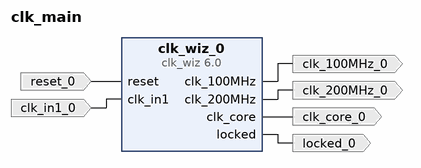
[diagram p0: block diagram of the top level]
# Vivado block design clk_main, xc7s50csga324-2, Vivado 2018.1
create_bd_design clk_main

create_bd_port -dir I -type rst reset_0
set_property -dict {CONFIG.POLARITY ACTIVE_HIGH} [get_bd_ports reset_0]
create_bd_port -dir I -type clk clk_in1_0
create_bd_port -dir O locked_0
create_bd_port -dir O -type clk clk_100MHz_0
create_bd_port -dir O -type clk clk_200MHz_0
set_property -dict {CONFIG.FREQ_HZ 200000000} [get_bd_ports clk_200MHz_0]
create_bd_port -dir O -type clk clk_core_0

create_bd_cell -type ip -vlnv xilinx.com:ip:clk_wiz:6.0 clk_wiz_0
set_property -dict [list \
  CONFIG.CLKOUT2_USED true \
  CONFIG.CLKOUT3_USED true \
  CONFIG.CLKOUT4_USED false \
  CONFIG.CLKOUT5_USED false \
  CONFIG.NUM_OUT_CLKS 3 \
  CONFIG.CLK_OUT1_PORT clk_100MHz \
  CONFIG.CLK_OUT2_PORT clk_200MHz \
  CONFIG.CLK_OUT3_PORT clk_core \
  CONFIG.CLK_OUT4_PORT clk_pixel \
  CONFIG.CLK_OUT5_PORT clk_out5 \
  CONFIG.CLKOUT2_REQUESTED_OUT_FREQ 200.000 \
  CONFIG.CLKOUT3_REQUESTED_OUT_FREQ 100 \
  CONFIG.CLKOUT4_REQUESTED_OUT_FREQ 74.25 \
  CONFIG.CLKOUT5_REQUESTED_OUT_FREQ 100.000 \
  CONFIG.MMCM_DIVCLK_DIVIDE 1 \
  CONFIG.MMCM_CLKFBOUT_MULT_F 10.000 \
  CONFIG.MMCM_CLKOUT0_DIVIDE_F 10.000 \
  CONFIG.MMCM_CLKOUT1_DIVIDE 5 \
  CONFIG.MMCM_CLKOUT2_DIVIDE 10 \
  CONFIG.MMCM_CLKOUT3_DIVIDE 1 \
  CONFIG.MMCM_CLKOUT4_DIVIDE 1 \
  CONFIG.CLKOUT1_JITTER 130.958 \
  CONFIG.CLKOUT1_PHASE_ERROR 98.575 \
  CONFIG.CLKOUT2_JITTER 114.829 \
  CONFIG.CLKOUT2_PHASE_ERROR 98.575 \
  CONFIG.CLKOUT3_JITTER 130.958 \
  CONFIG.CLKOUT3_PHASE_ERROR 98.575 \
  CONFIG.CLKOUT4_JITTER 107.567 \
  CONFIG.CLKOUT4_PHASE_ERROR 87.180 \
  CONFIG.CLKOUT5_JITTER 115.831 \
  CONFIG.CLKOUT5_PHASE_ERROR 87.180 \
] [get_bd_cells clk_wiz_0]

# ---- connections ----

connect_bd_net -net reset_0_1 [get_bd_ports reset_0] [get_bd_pins clk_wiz_0/reset]
connect_bd_net -net clk_in1_0_1 [get_bd_ports clk_in1_0] [get_bd_pins clk_wiz_0/clk_in1]
connect_bd_net [get_bd_pins clk_wiz_0/locked] [get_bd_ports locked_0]
connect_bd_net [get_bd_pins clk_wiz_0/clk_100MHz] [get_bd_ports clk_100MHz_0]
connect_bd_net [get_bd_pins clk_wiz_0/clk_200MHz] [get_bd_ports clk_200MHz_0]
connect_bd_net [get_bd_pins clk_wiz_0/clk_core] [get_bd_ports clk_core_0]

validate_bd_design
save_bd_design
